# EAGLE schematic stm32-lqfp64-adapter (EAGLE 7.2.0)
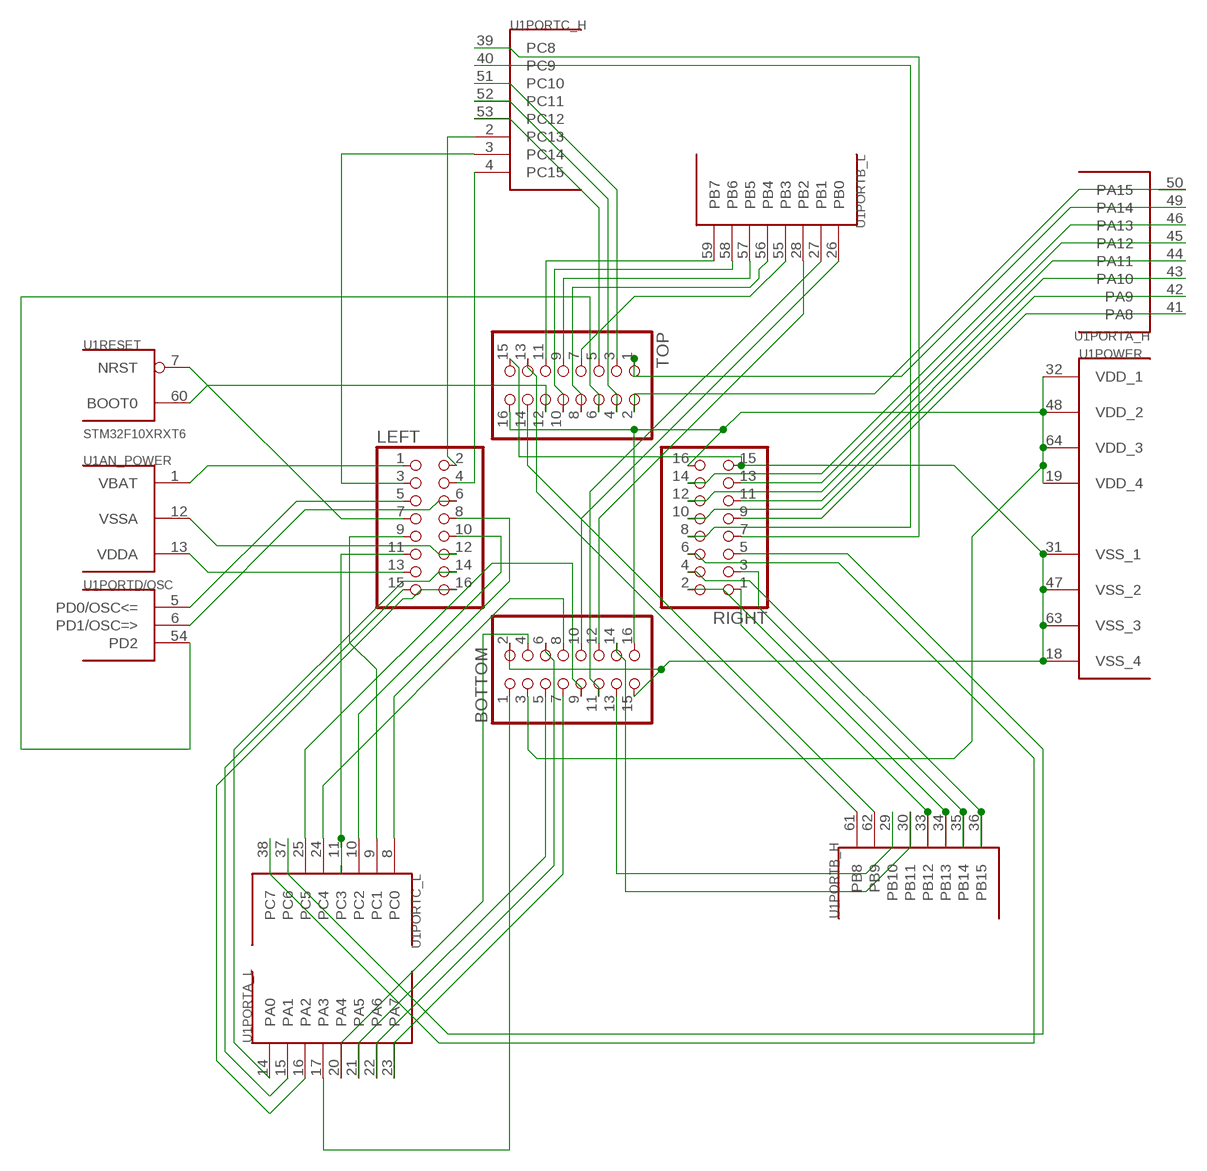
[diagram p0: schematic, sheet 1]

## Parts
BOTTOM  PINHD-2X08_2.54  [2X08]
LEFT  PINHD-2X08_2.54  [2X08]
RIGHT  PINHD-2X08_2.54  [2X08]
TOP  PINHD-2X08_2.54  [2X08]
U1  STM32F10XRXT6  [TQFP64]

## Nets
N$1: LEFT.1 U1.1(AN_POWER:VBAT)
N$2: LEFT.12 U1.12(AN_POWER:VSSA)
N$3: LEFT.13 U1.13(AN_POWER:VDDA)
N$4: LEFT.5 U1.5(PORTD/OSC:PD0/OSC<=)
N$5: LEFT.6 U1.6(PORTD/OSC:PD1/OSC=>)
N$6: TOP.6 U1.54(PORTD/OSC:PD2)
N$7: LEFT.7 U1.7(RESET:NRST)
N$8: TOP.12 U1.60(RESET:BOOT0)
N$9: LEFT.2 U1.2(PORTC_H:PC13)
N$10: LEFT.3 U1.3(PORTC_H:PC14)
N$11: LEFT.4 U1.4(PORTC_H:PC15)
N$12: LEFT.8 U1.8(PORTC_L:PC0)
N$13: LEFT.9 U1.9(PORTC_L:PC1)
N$14: LEFT.10 U1.10(PORTC_L:PC2)
N$15: LEFT.11 U1.11(PORTC_L:PC3)
N$16: LEFT.14 U1.14(PORTA_L:PA0)
N$17: LEFT.15 U1.15(PORTA_L:PA1)
N$18: LEFT.16 U1.16(PORTA_L:PA2)
N$19: BOTTOM.1 U1.17(PORTA_L:PA3)
N$20: BOTTOM.8 U1.24(PORTC_L:PC4)
N$21: BOTTOM.2 BOTTOM.15 RIGHT.15 TOP.15 U1.18(POWER:VSS_4) U1.31(POWER:VSS_1) U1.47(POWER:VSS_2) U1.63(POWER:VSS_3)
N$22: BOTTOM.3 BOTTOM.16 RIGHT.16 TOP.16 U1.19(POWER:VDD_4) U1.32(POWER:VDD_1) U1.48(POWER:VDD_2) U1.64(POWER:VDD_3)
N$23: BOTTOM.4 U1.20(PORTA_L:PA4)
N$24: BOTTOM.5 U1.21(PORTA_L:PA5)
N$25: BOTTOM.6 U1.22(PORTA_L:PA6)
N$26: BOTTOM.7 U1.23(PORTA_L:PA7)
N$27: BOTTOM.9 U1.25(PORTC_L:PC5)
N$28: BOTTOM.10 U1.26(PORTB_L:PB0)
N$29: BOTTOM.11 U1.27(PORTB_L:PB1)
N$30: BOTTOM.12 U1.28(PORTB_L:PB2)
N$31: BOTTOM.13 U1.29(PORTB_H:PB10)
N$32: BOTTOM.14 U1.30(PORTB_H:PB11)
N$33: RIGHT.1 U1.33(PORTB_H:PB12)
N$34: RIGHT.2 U1.34(PORTB_H:PB13)
N$35: RIGHT.3 U1.35(PORTB_H:PB14)
N$36: RIGHT.4 U1.36(PORTB_H:PB15)
N$37: RIGHT.5 U1.37(PORTC_L:PC6)
N$38: RIGHT.6 U1.38(PORTC_L:PC7)
N$39: RIGHT.7 U1.39(PORTC_H:PC8)
N$40: RIGHT.8 U1.40(PORTC_H:PC9)
N$41: TOP.3 U1.51(PORTC_H:PC10)
N$42: RIGHT.9 U1.41(PORTA_H:PA8)
N$43: RIGHT.10 U1.42(PORTA_H:PA9)
N$44: RIGHT.11 U1.43(PORTA_H:PA10)
N$45: RIGHT.12 U1.44(PORTA_H:PA11)
N$46: RIGHT.13 U1.45(PORTA_H:PA12)
N$47: RIGHT.14 U1.46(PORTA_H:PA13)
N$48: TOP.1 U1.49(PORTA_H:PA14)
N$49: TOP.2 U1.50(PORTA_H:PA15)
N$50: TOP.4 U1.52(PORTC_H:PC11)
N$51: TOP.5 U1.53(PORTC_H:PC12)
N$52: TOP.13 U1.61(PORTB_H:PB8)
N$53: TOP.14 U1.62(PORTB_H:PB9)
N$54: TOP.11 U1.59(PORTB_L:PB7)
N$55: TOP.10 U1.58(PORTB_L:PB6)
N$56: TOP.9 U1.57(PORTB_L:PB5)
N$57: TOP.8 U1.56(PORTB_L:PB4)
N$58: TOP.7 U1.55(PORTB_L:PB3)

## Library data of the parts
BOTTOM LEFT RIGHT TOP = pinhead-2:PINHD-2X08: PIN HEADER
U1 = stm32:STM32F10XRXT6: STM32F101/103 64pin LQFP